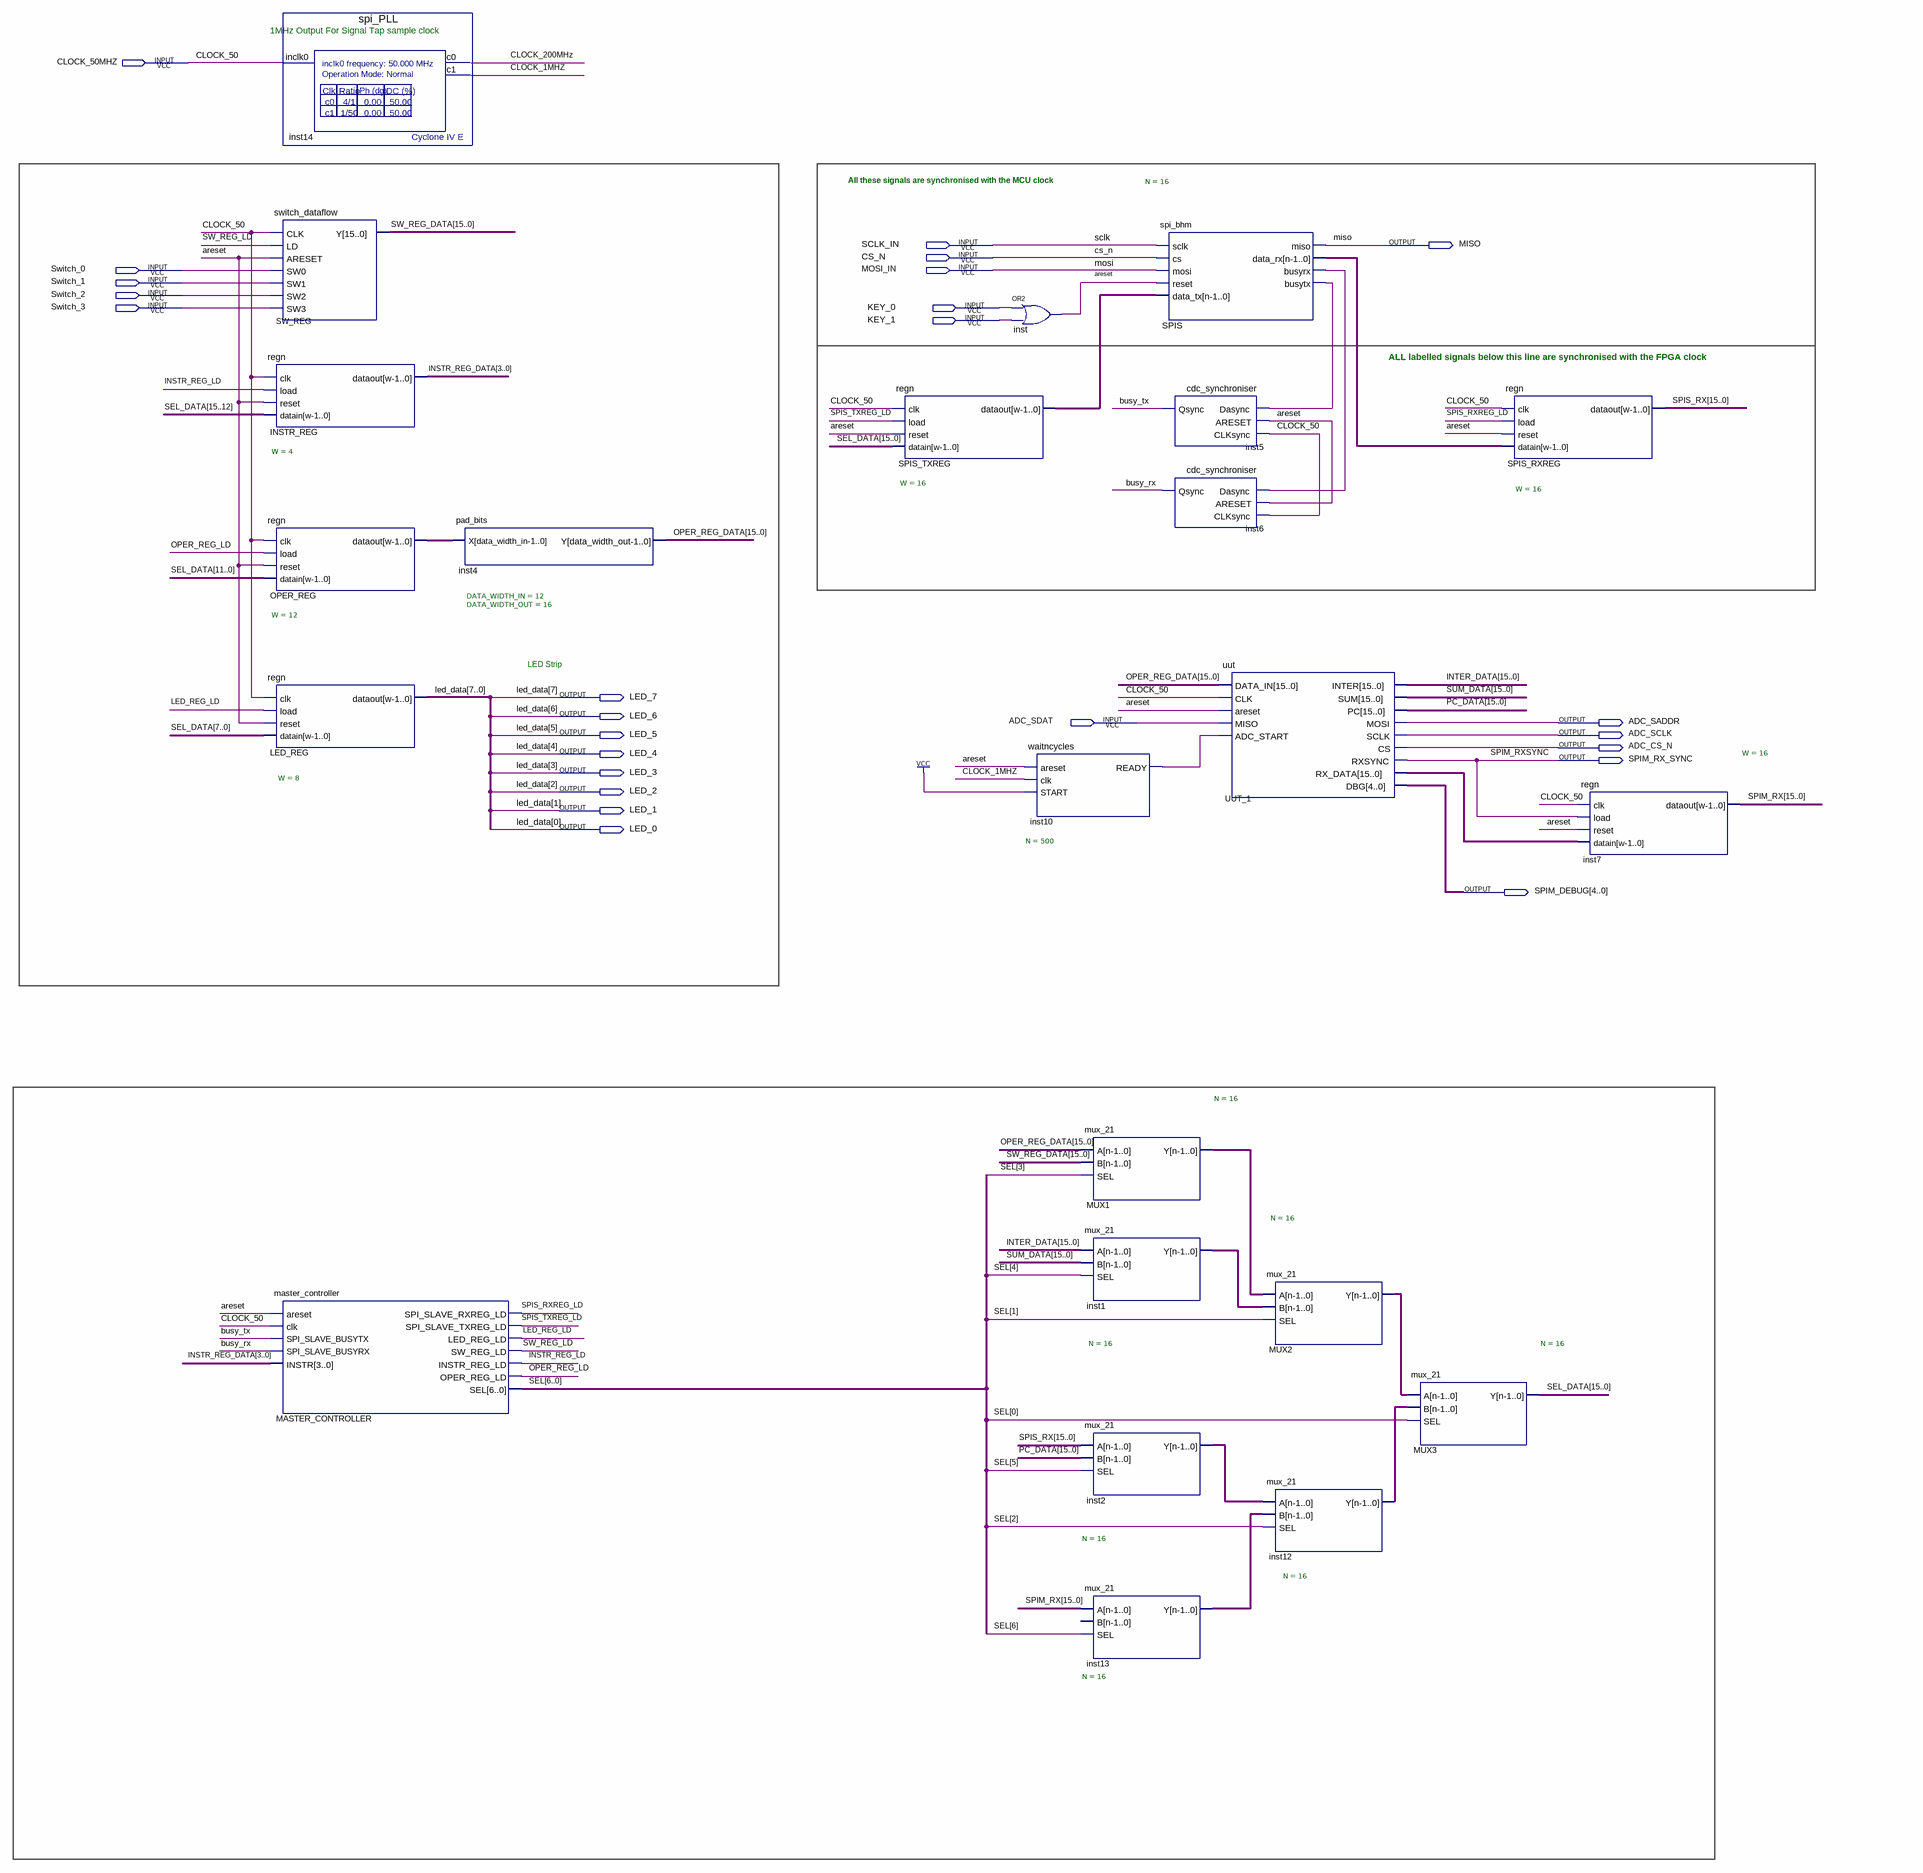
[diagram p0: schematic sheet]
// Quartus schematic spi_test.bdf as structural Verilog: 23 symbols, 25 pins
module spi_test (
  input  CLOCK_50MHZ,
  input  SCLK_IN,
  input  CS_N,
  input  Switch_0,
  input  MOSI_IN,
  input  Switch_1,
  input  Switch_2,
  input  Switch_3,
  input  KEY_0,
  input  KEY_1,
  input  ADC_SDAT,
  output MISO,
  output LED_7,
  output LED_6,
  output ADC_SADDR,
  output LED_5,
  output ADC_SCLK,
  output ADC_CS_N,
  output LED_4,
  output SPIM_RX_SYNC,
  output LED_3,
  output LED_2,
  output LED_1,
  output LED_0,
  output [4:0] SPIM_DEBUG
);

  wire areset, busy_rx, busy_tx, CLOCK_1MHZ, CLOCK_200MHz, inst10_ready, INSTR_REG_LD, LED_REG_LD,
       OPER_REG_LD, SPIS_busyrx, SPIS_busytx, SPIS_RXREG_LD, SPIS_TXREG_LD, SW_REG_LD;
  wire [3:0] INSTR_REG_DATA;
  wire [6:0] SEL;
  wire [11:0] OPER_REG_dataout;
  wire [15:0] inst1_y, inst2_y, inst12_y, inst13_y, INTER_DATA, MUX1_y, MUX2_y, OPER_REG_DATA, PC_DATA,
       SEL_DATA, SPIM_RX, SPIS_data_rx, SPIS_RX, SPIS_TXREG_dataout, SUM_DATA, SW_REG_DATA, UUT_1_rx_data;

  switch_dataflow SW_REG (
    .CLK(CLOCK_50MHZ), .LD(SW_REG_LD), .ARESET(areset), .SW0(Switch_0), .SW1(Switch_1), .SW2(Switch_2),
    .SW3(Switch_3), .Y(SW_REG_DATA));
  regn #(.W(4)) INSTR_REG (
    .clk(CLOCK_50MHZ), .load(INSTR_REG_LD), .reset(areset), .datain(SEL_DATA[15:12]), .dataout(INSTR_REG_DATA));
  regn #(.W(12)) OPER_REG (
    .clk(CLOCK_50MHZ), .load(OPER_REG_LD), .reset(areset), .datain(SEL_DATA[11:0]), .dataout(OPER_REG_dataout));
  regn #(.W(8)) LED_REG (
    .clk(CLOCK_50MHZ), .load(LED_REG_LD), .reset(areset), .datain(SEL_DATA[7:0]),
    .dataout({LED_7, LED_6, LED_5, LED_4, LED_3, LED_2, LED_1, LED_0}));
  master_controller MASTER_CONTROLLER (
    .areset(areset), .clk(CLOCK_50MHZ), .SPI_SLAVE_BUSYTX(busy_tx), .SPI_SLAVE_BUSYRX(busy_rx),
    .INSTR(INSTR_REG_DATA), .SPI_SLAVE_RXREG_LD(SPIS_RXREG_LD), .SPI_SLAVE_TXREG_LD(SPIS_TXREG_LD),
    .LED_REG_LD(LED_REG_LD), .SW_REG_LD(SW_REG_LD), .INSTR_REG_LD(INSTR_REG_LD), .OPER_REG_LD(OPER_REG_LD),
    .SEL(SEL));
  spi_PLL inst14 (.inclk0(CLOCK_50MHZ), .c0(CLOCK_200MHz), .c1(CLOCK_1MHZ));
  pad_bits #(.DATA_WIDTH_IN(12), .DATA_WIDTH_OUT(16)) inst4 (.X(OPER_REG_dataout), .Y(OPER_REG_DATA));
  regn #(.W(16)) SPIS_TXREG (
    .clk(CLOCK_50MHZ), .load(SPIS_TXREG_LD), .reset(areset), .datain(SEL_DATA), .dataout(SPIS_TXREG_dataout));
  or inst (areset, KEY_0, KEY_1);
  waitncycles #(.N(500)) inst10 (.areset(areset), .clk(CLOCK_1MHZ), .START(1'b1), .READY(inst10_ready));
  mux_21 #(.N(16)) MUX1 (.A(OPER_REG_DATA), .B(SW_REG_DATA), .SEL(SEL[3]), .Y(MUX1_y));
  mux_21 #(.N(16)) inst1 (.A(INTER_DATA), .B(SUM_DATA), .SEL(SEL[4]), .Y(inst1_y));
  mux_21 #(.N(16)) inst2 (.A(SPIS_RX), .B(PC_DATA), .SEL(SEL[5]), .Y(inst2_y));
  mux_21 #(.N(16)) inst13 (.A(SPIM_RX), .SEL(SEL[6]), .Y(inst13_y));  // open: B
  spi_bhm #(.N(16)) SPIS (
    .sclk(SCLK_IN), .cs(CS_N), .mosi(MOSI_IN), .reset(areset), .data_tx(SPIS_TXREG_dataout), .miso(MISO),
    .data_rx(SPIS_data_rx), .busyrx(SPIS_busyrx), .busytx(SPIS_busytx));
  cdc_synchroniser inst5 (.Dasync(SPIS_busytx), .ARESET(areset), .CLKsync(CLOCK_50MHZ), .Qsync(busy_tx));
  cdc_synchroniser inst6 (.Dasync(SPIS_busyrx), .ARESET(areset), .CLKsync(CLOCK_50MHZ), .Qsync(busy_rx));
  uut UUT_1 (
    .DATA_IN(OPER_REG_DATA), .CLK(CLOCK_50MHZ), .areset(areset), .MISO(ADC_SDAT), .ADC_START(inst10_ready),
    .INTER(INTER_DATA), .SUM(SUM_DATA), .PC(PC_DATA), .MOSI(ADC_SADDR), .SCLK(ADC_SCLK), .CS(ADC_CS_N),
    .RXSYNC(SPIM_RX_SYNC), .RX_DATA(UUT_1_rx_data), .DBG(SPIM_DEBUG));
  mux_21 #(.N(16)) MUX2 (.A(MUX1_y), .B(inst1_y), .SEL(SEL[1]), .Y(MUX2_y));
  mux_21 #(.N(16)) inst12 (.A(inst2_y), .B(inst13_y), .SEL(SEL[2]), .Y(inst12_y));
  mux_21 #(.N(16)) MUX3 (.A(MUX2_y), .B(inst12_y), .SEL(SEL[0]), .Y(SEL_DATA));
  regn #(.W(16)) SPIS_RXREG (
    .clk(CLOCK_50MHZ), .load(SPIS_RXREG_LD), .reset(areset), .datain(SPIS_data_rx), .dataout(SPIS_RX));
  regn #(.W(16)) inst7 (
    .clk(CLOCK_50MHZ), .load(SPIM_RX_SYNC), .reset(areset), .datain(UUT_1_rx_data), .dataout(SPIM_RX));

  // Other names for the same wires on the sheet: CLOCK_50 = CLOCK_50MHZ;
  //   led_data[7:0] = {LED_7, LED_6, LED_5, LED_4, LED_3, LED_2, LED_1, LED_0}; mosi = MOSI_IN; sclk = SCLK_IN;
  //   SPIM_RXSYNC = SPIM_RX_SYNC

  // Notes on the sheet:
  //   1MHz Output For Signal Tap sample clock
  //   All these signals are synchronised with the MCU clock
  //   ALL labelled signals below this line are synchronised with the FPGA clock
  //   LED Strip
endmodule
